# EAGLE design proto_Feather_with_Weather_0v20 (EAGLE 7.5.0)
COMPANY: ADAFRUIT INDUSTRIES; DRAWN: KTOWN; REV: B
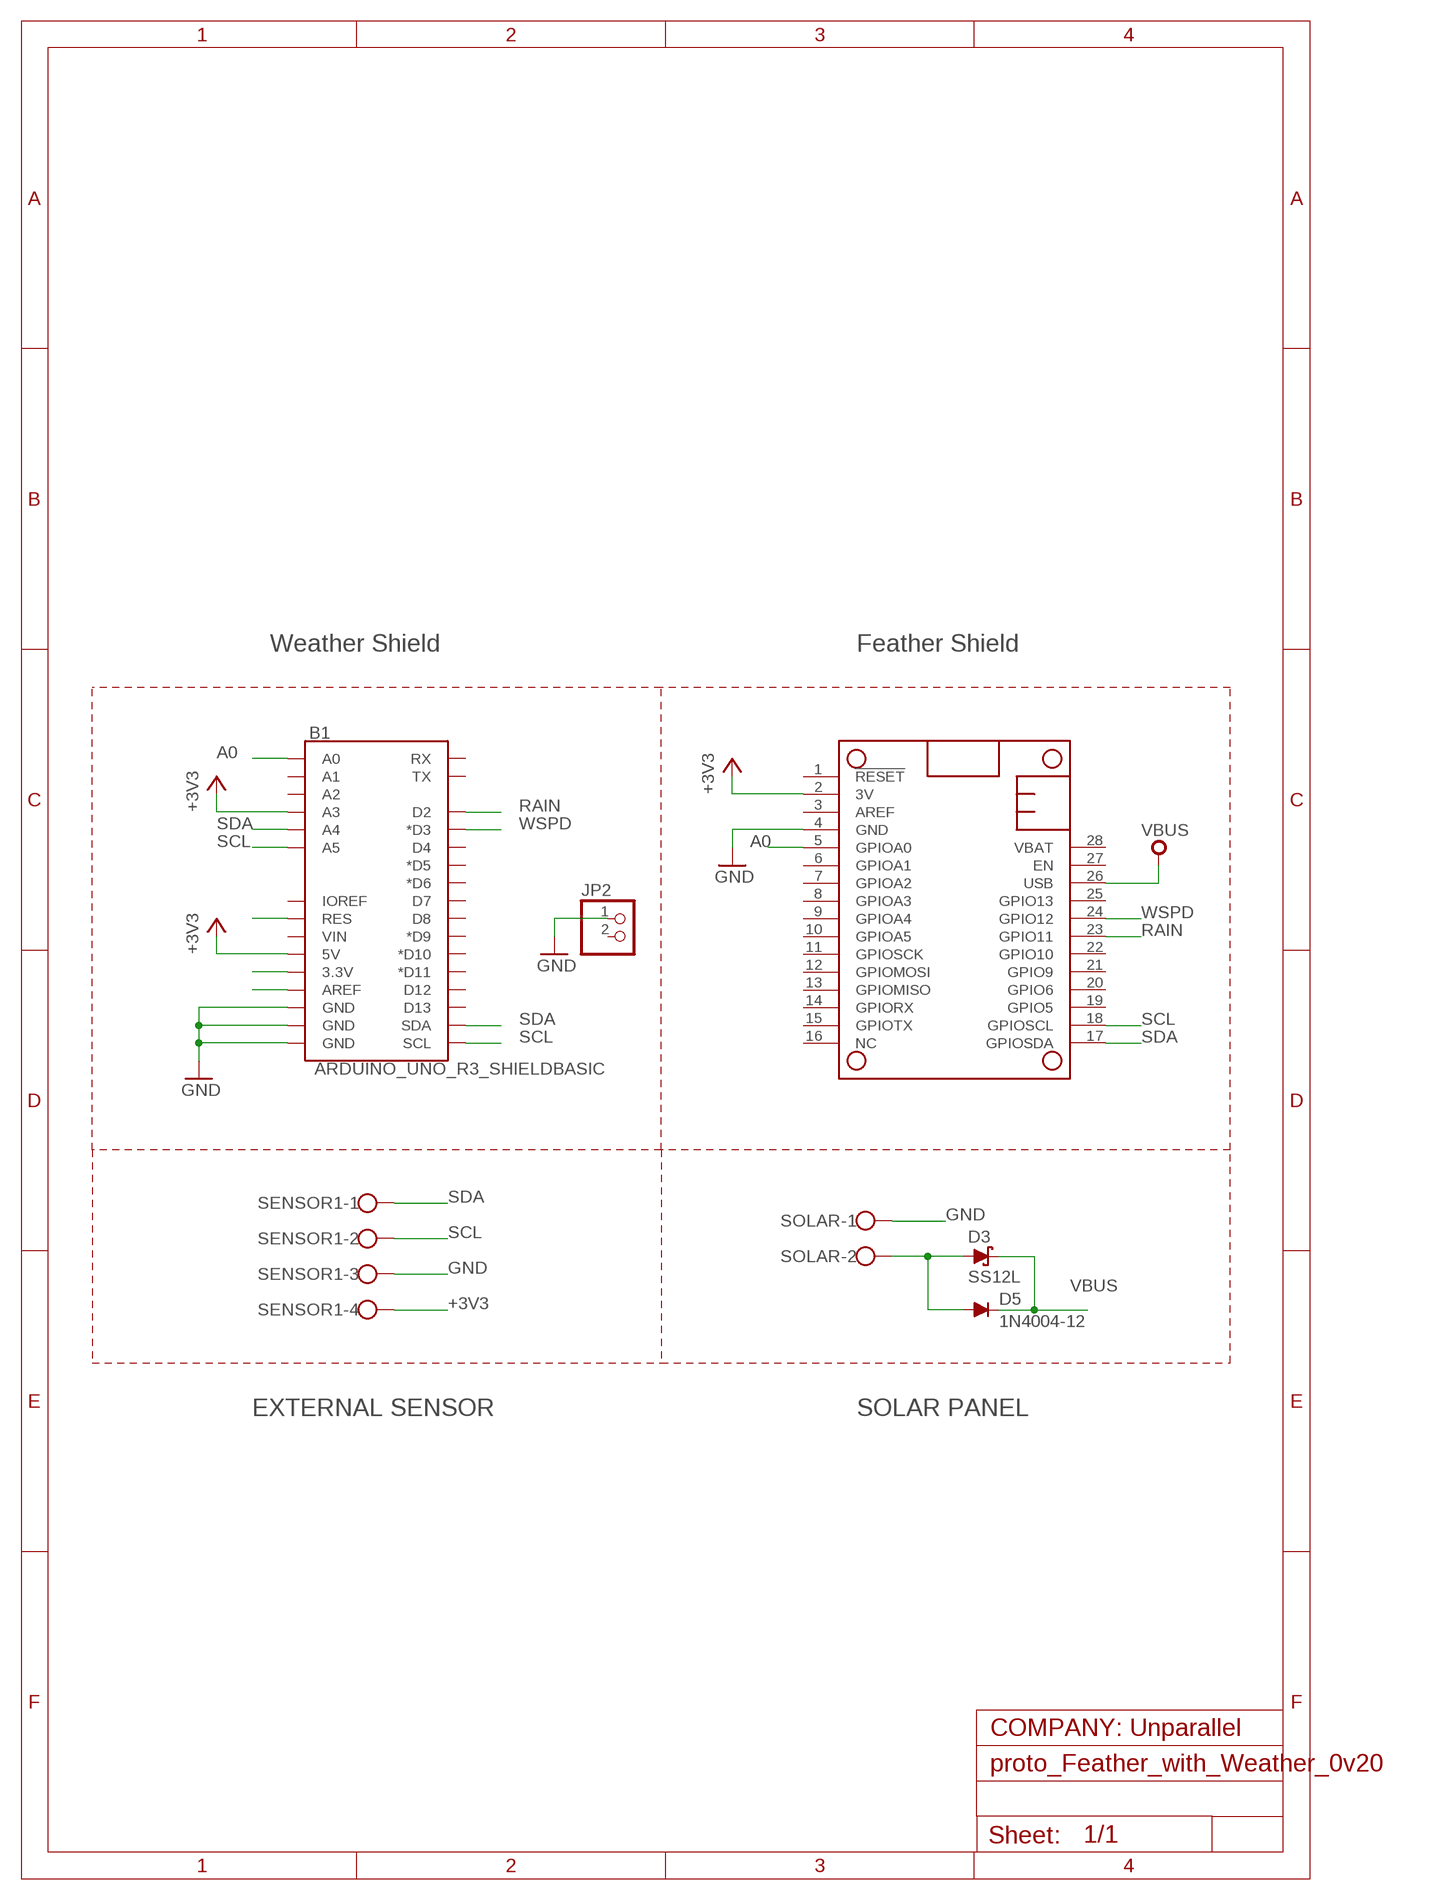
[diagram p0: schematic, sheet 1]

## Parts
B1  ARDUINO_UNO_R3_SHIELDBASIC  [UNO_R3_SHIELD]
D3  SS12L  SCHOTTKY-DIODESUB_SMA_PROTO  [SUB_SMA_PROTO]
D5  1N4004-12  [DO41-12]
JP2  PINHD-1X2  [1X02]
MS2  FEATHERWING_NODIM  [FEATHERWING_DIM]
SENSOR1  W237-4  [W237-4]
SOLAR  W237-102  [W237-102]

## Nets
+3V3: B1.5V B1.A3 MS2.2(3V) SENSOR1.4
A0: B1.A0 MS2.5(GPIOA0)
GND: B1.GND@0(GND) B1.GND@1(GND) B1.GND@2(GND) JP2.1 MS2.4(GND) SENSOR1.3 SOLAR.1
N$1: D3.A D5.A SOLAR.2
N$28: B1.AREF
N$29: B1.3.3V
N$32: B1.RES
RAIN: B1.D2 MS2.23(GPIO11)
SCL: B1.A5 B1.SCL MS2.18(GPIOSCL) SENSOR1.2
SDA: B1.A4 B1.SDA MS2.17(GPIOSDA) SENSOR1.1
VBUS: D3.C D5.C MS2.26(USB)
WSPD: B1.D3(*D3) MS2.24(GPIO12)
Unconnected: B1.A1 B1.A2 B1.D4 B1.D5(*D5) B1.D6(*D6) B1.D7 B1.D8 B1.D9(*D9) B1.D10(*D10) B1.D11(*D11) B1.D12 B1.D13 B1.IOREF B1.RX B1.TX B1.VIN JP2.2 MS2.1(!RESET) MS2.3(AREF) MS2.6(GPIOA1) MS2.7(GPIOA2) MS2.8(GPIOA3) MS2.9(GPIOA4) MS2.10(GPIOA5) MS2.11(GPIOSCK) MS2.12(GPIOMOSI) MS2.13(GPIOMISO) MS2.14(GPIORX) MS2.15(GPIOTX) MS2.16(NC) MS2.19(GPIO5) MS2.20(GPIO6) MS2.21(GPIO9) MS2.22(GPIO10) MS2.25(GPIO13) MS2.27(EN) MS2.28(VBAT)

## Notes on the sheet
- Weather Shield | Feather Shield
- EXTERNAL SENSOR | SOLAR PANEL

## Library data of the parts
B1 = SparkFun-Boards:ARDUINO_UNO_R3_SHIELD: Arduino R3 Shield Footprint Shield form compatible with the Arduino Uno R3. SparkFun Products: MG2639 Cellular Shield <https://www.sparkfun.com/products/13120> MIDI Shield <https://www.sparkfun.com/products/12898> R3 Stackable Headers Kit <https://www.sparkfun.com/products/11417>
D3 = diode:SCHOTTKY-DIODE: Schottky Diode
D5 = diode:1N4004: DIODE general purpose rectifier, 1 A
JP2 = pinhead:PINHD-1X2: PIN HEADER
MS2 = adafruit_edit:FEATHERWING
SENSOR1 = con-wago-500:W237-4: WAGO SCREW CLAMP
SOLAR = con-wago-500:W237-102: WAGO SCREW CLAMP

## Net classes
2 VDD_3.3V: width 0.35 mm, drill 0.3 mm, clearance 0.2 mm

## Board
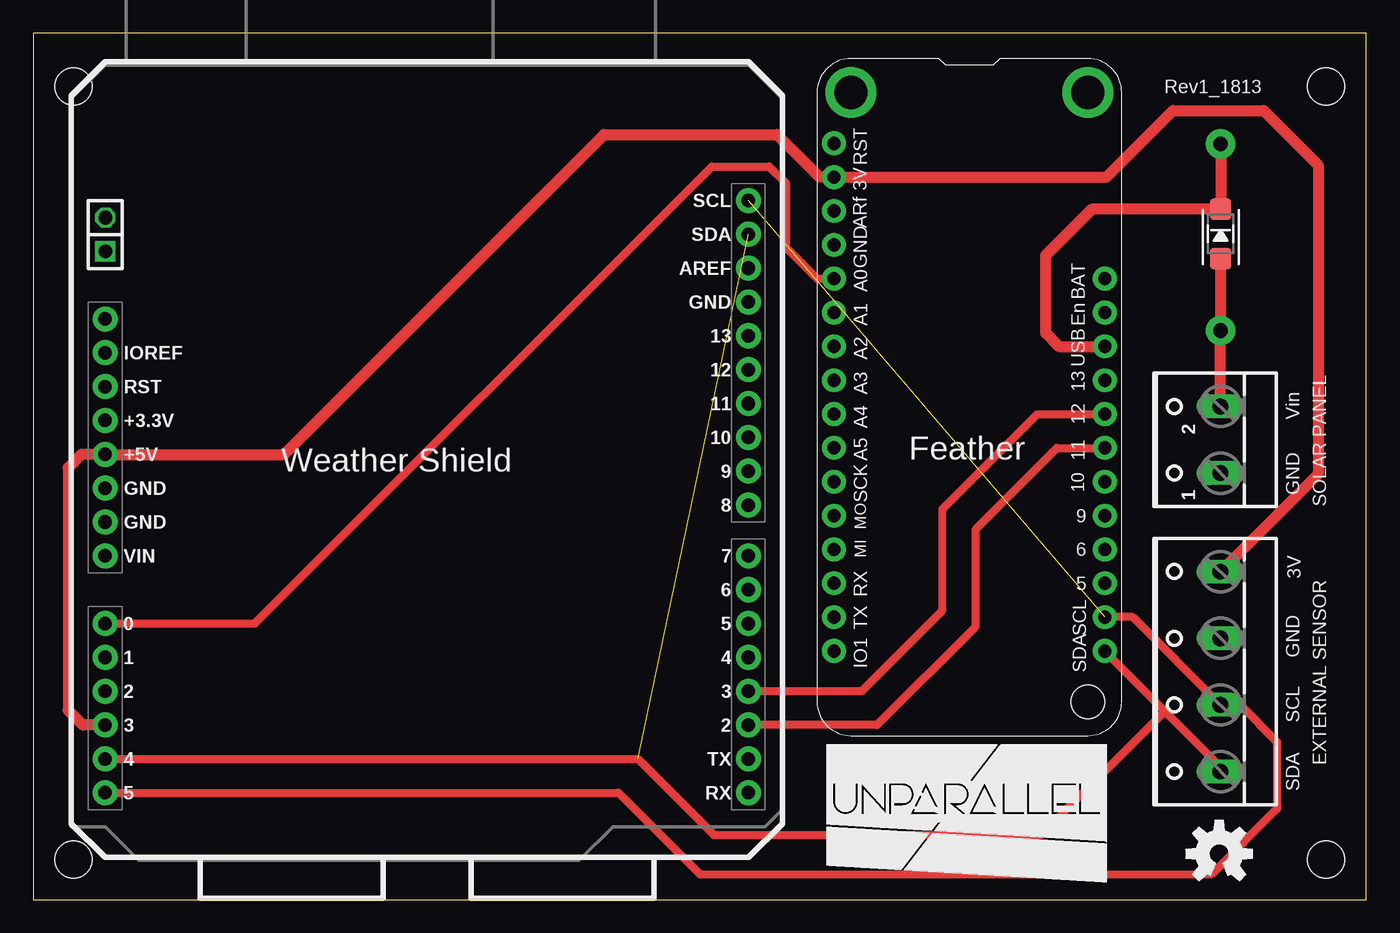
[diagram p1: board, top side]
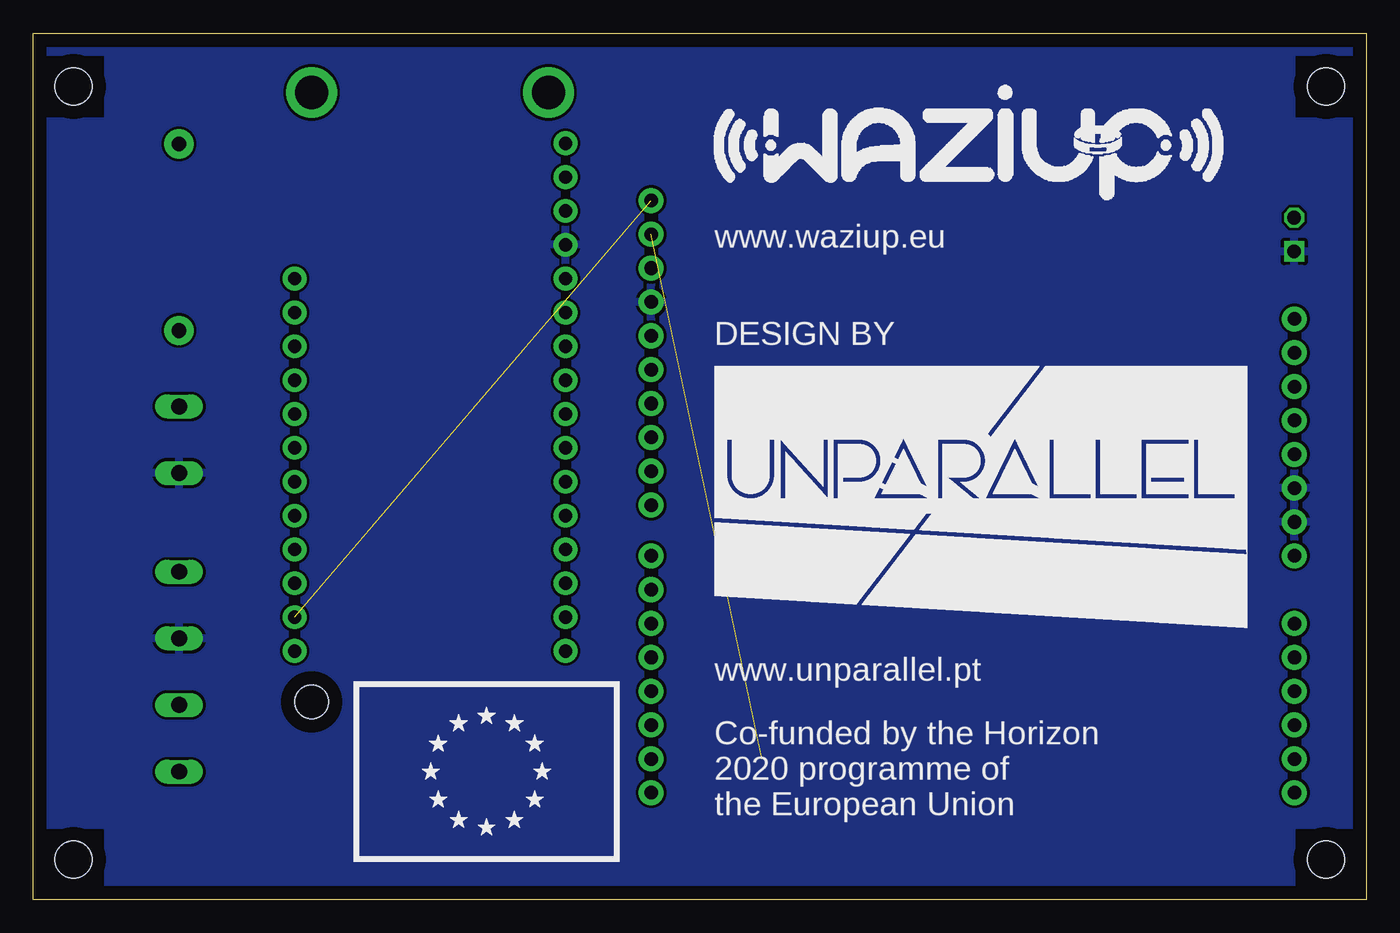
[diagram p2: board, bottom side, seen from below]

Size 100 x 65 mm. Coordinates in mm from the lower left corner, seen from the top.
Outline: 0,0 100,0 100,65 0,65 0,0
Copper layers (1*16): Top 0.035mm / dielectric 1.5mm / Bottom 0.035mm
Design rules "default": minimum track width 10mil, minimum drill 24mil, track to track 8mil, track to pad 8mil, pad to pad 8mil, via to via 8mil, smd to smd 8mil, copper to edge 40mil, drill to drill 8mil, minimum pad ring 10mil, minimum via ring 8mil, stop-mask expansion 4mil, vias tented up to drill 0mil, thermal gap 10mil
Holes 2.54 mm at 79.11,14.83

### Footprints (pad centres in the part's own frame; a part is rotated, then mirrored left to right if it is on the bottom)
UNO_R3_SHIELD = drill 1.016 pad 1.88: 3.3V 24.13,-2.54; 5V 24.13,0; A0 24.13,12.7; A1 24.13,15.24; A2 24.13,17.78; A3 24.13,20.32; A4 24.13,22.86; A5 24.13,25.4; AREF -24.13,-13.97; D2 -24.13,20.32; D3 -24.13,17.78; D4 -24.13,15.24; D5 -24.13,12.7; D6 -24.13,10.16; D7 -24.13,7.62; D8 -24.13,3.81; D9 -24.13,1.27; D10 -24.13,-1.27; D11 -24.13,-3.81; D12 -24.13,-6.35; D13 -24.13,-8.89; GND@0 24.13,2.54; GND@1 24.13,5.08; GND@2 -24.13,-11.43; IOREF 24.13,-7.62; NC 24.13,-10.16; RES 24.13,-5.08; RX -24.13,25.4; SCL -24.13,-19.05; SDA -24.13,-16.51; TX -24.13,22.86; VIN 24.13,7.62
SUB_SMA_PROTO = smd 1.6 x 1.6: A 1.85,0; C -1.85,0
DO41-12 = drill 1.118 pad 2.184: A 7,0; C -7,0
1X02 = drill 1.016 square: 1 -1.27,0 | drill 1.016 octagon: 2 1.27,0
FEATHERWING_DIM = drill 1 pad 1.778: 1 6.35,1.27; 2 8.89,1.27; 3 11.43,1.27; 4 13.97,1.27; 5 16.51,1.27; 6 19.05,1.27; 7 21.59,1.27; 8 24.13,1.27; 9 26.67,1.27; 10 29.21,1.27; 11 31.75,1.27; 12 34.29,1.27; 13 36.83,1.27; 14 39.37,1.27; 15 41.91,1.27; 16 44.45,1.27; 17 44.45,21.59; 18 41.91,21.59; 19 39.37,21.59; 20 36.83,21.59; 21 34.29,21.59; 22 31.75,21.59; 23 29.21,21.59; 24 26.67,21.59; 25 24.13,21.59; 26 21.59,21.59; 27 19.05,21.59; 28 16.51,21.59 | drill 2.5 pad 3.81: P$1 2.54,20.32; P$2 2.54,2.54 | hole 2.54: 48.26,20.32
W237-4 = drill 1.194 long: 1 -7.5,-1.27; 2 -2.5,-1.27; 3 2.5,-1.27; 4 7.5,-1.27
W237-102 = drill 1.194 long: 1 -2.5,-1.27; 2 2.5,-1.27
MOUNTHOLE_110MIL = hole 2.794: 0,0

### Placement (x,y rotation side)
B1  29.51,33.41 180 top
D3  89.08,49.95 270 top
D5  89.08,49.7 270 top
JP2  5.4,49.9 90 top
LOGO1  OSHW-LOGOM  [OSHW-LOGO-M]  88.97,3.43 0 top
MS2  58.8,63.1 270 top
SENSOR1  87.8,17.1 90 top
SOLAR  87.8,34.5 90 top
STAND1  [MOUNTHOLE_110MIL]  97,3 90 top
STAND2  [MOUNTHOLE_110MIL]  3,3 90 top
STAND3  [MOUNTHOLE_110MIL]  3,61 90 top
STAND4  [MOUNTHOLE_110MIL]  97,61 90 top
U$1  [UNPARALLEL_LOGO_NEW_0_INVERT_BIG]  59.5,1.3 0 top
U$2  [FLAG_EU]  76,2.8 0 bottom
U$3  [LOGO_WAZIUP_4CM]  49.7,51.4 0 bottom
U$4  [UNPARALLEL_LOGO_NEW_0_INVERT_4CM]  48.9,20.4 0 bottom

### Tracks (layer width: path | path; a pad name or v marks a point on that pad's centre or on a via)
+3V3
  Top 0.813: 80.5,54.2 80.51,54.21 | SENSOR1.4 96.4,31.93 96.4,55.1 92.3,59.2 85.5,59.2 81,54.7 80.51,54.21 | B1.A3 3.71,13.09 2.6,14.2 2.6,32.4 3.61,33.41 B1.5V 18.81,33.41 42.8,57.4 55.8,57.4 58.99,54.21 MS2.2 80.51,54.21
A0
  Top 0.61: B1.A0 16.61,20.71 50.9,55 55.2,55 56.5,53.7 56.5,48.9 58.81,46.59 MS2.5
GND
  pour Bottom: 0,0 100,0 100,65 0,65
N$1
  Top 0.813: SOLAR.2 D5.A D3.A
RAIN
  Top 0.61: MS2.23 76.79,33.89 70.7,27.8 70.7,20.5 63.29,13.09 B1.D2
SCL  (1 unrouted)
  Top 0.61: B1.A5 43.89,8.01 50,1.9 88.4,1.9 93.3,6.8 93.3,11.85 90.55,14.6 SENSOR1.2 82.48,21.19 MS2.18
SDA  (1 unrouted)
  Top 0.61: 84.89,14.13 89.07,9.95 SENSOR1.1 | 84.89,14.13 75.6,4.85 51.05,4.85 45.35,10.55 B1.A4 | 84.89,14.13 80.39,18.63 MS2.17
VBUS
  Top 0.813: D5.C D3.C 79.4,51.8 75.95,48.35 75.95,42.5 76.94,41.51 MS2.26
WSPD
  Top 0.61: MS2.24 75.33,36.43 68.2,29.3 68.2,21.7 62.13,15.63 B1.D3

### Text on the board
tPlace: Rev1_1813 | Vin | Feather | Weather Shield | GND | SOLAR PANEL | 3V | GND | SCL | SDA | EXTERNAL SENSOR
bPlace: www.waziup.eu | DESIGN BY | www.unparallel.pt | Co-funded by the Horizon / 2020 programme of / the European Union